# Altium project PCB_WSD.PrjPCB
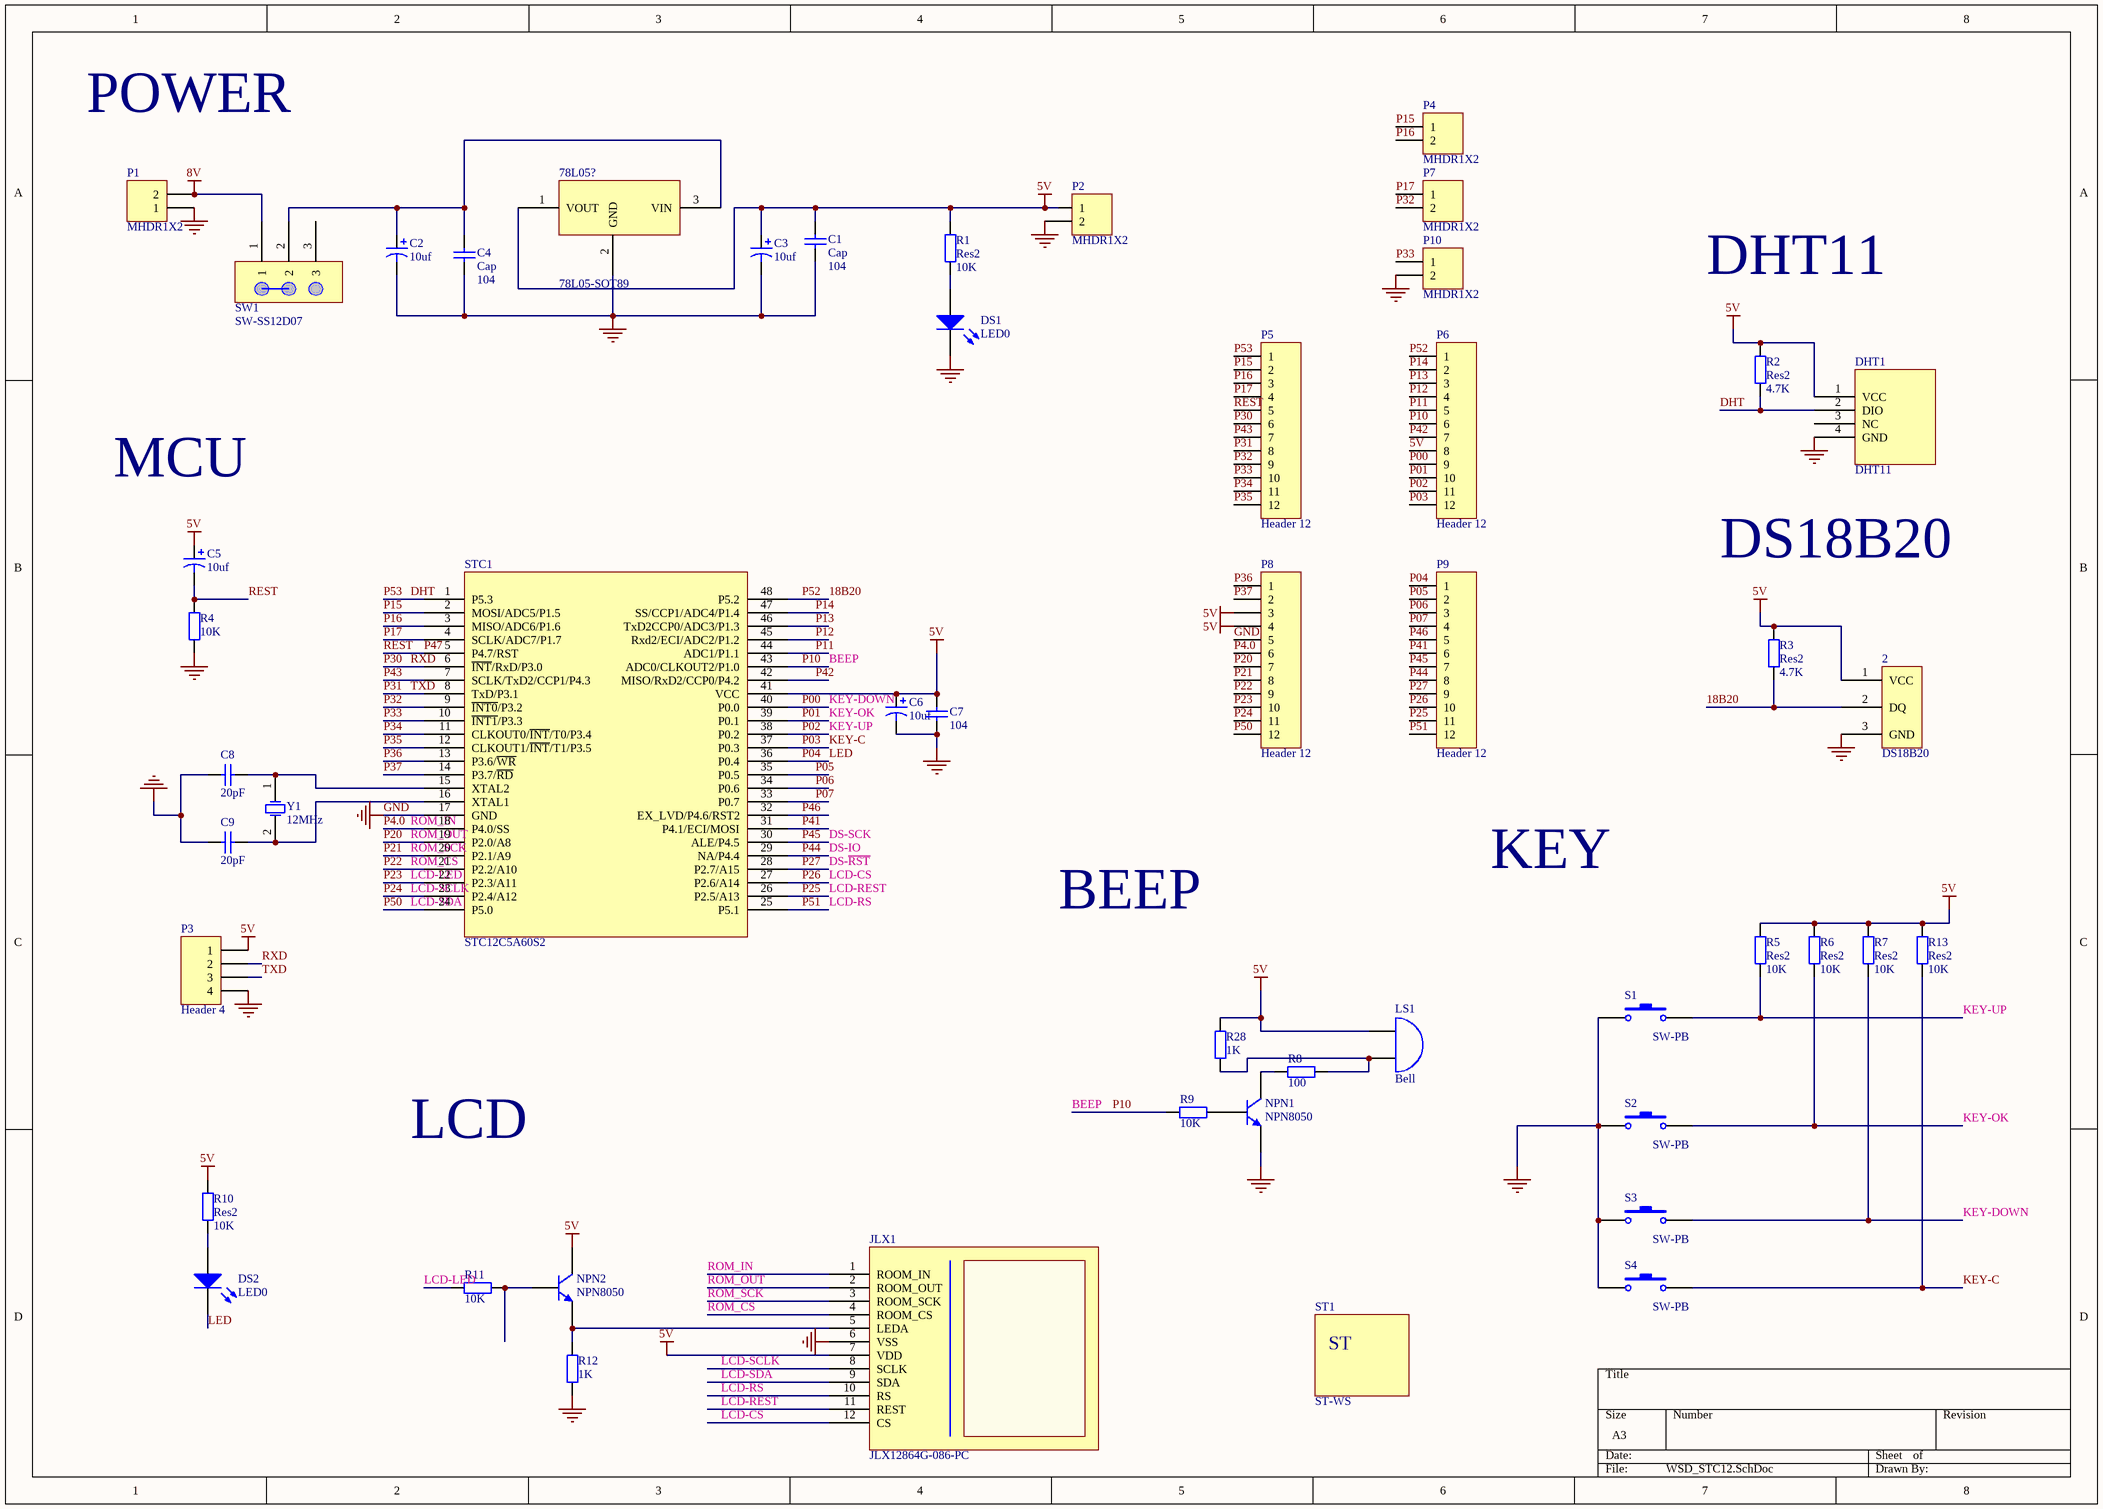
[diagram p0: WSD_STC12.SchDoc]
1 sheet, 50 parts. Net scope: global (net labels, ports and power ports of the same name join across sheets).
Board file: PCB_WSD.PcbDoc

## Sheet WSD_STC12.SchDoc
size A3

### Parts
2  DS18B20  [HDR1X3]
78L05?  78L05-SOT89  [SOT89]
C1  Cap  value 104  [0603]
C2  10uf  [C310M]
C3  10uf  [C310M]
C4  Cap  value 104  [0603]
C5  10uf  [C310M]
C6  10uf  [C310M]
C7  104  [0603]
C8  20pF  [P0603]
C9  20pF  [P0603]
DHT1  DHT11  [HDR1X4]
DS1  LED0  [LED2012]
DS2  LED0  [LED2012]
JLX1  JLX12864G-086-PC  [HDR1X12]
LS1  Bell  [BEEP]
NPN1  NPN8050  [SOT23-T]
NPN2  NPN8050  [SOT23-T]
P1  MHDR1X2  [KF301-2P]
P2  MHDR1X2  [KF301-2P]
P3  Header 4  [HDR1X4]
P4  MHDR1X2  [KF301-2P]
P5  Header 12  [HDR1X12]
P6  Header 12  [HDR1X12]
P7  MHDR1X2  [KF301-2P]
P8  Header 12  [HDR1X12]
P9  Header 12  [HDR1X12]
P10  MHDR1X2  [KF301-2P]
R1  Res2  value 10K  [0603]
R2  Res2  value 4.7K  [0603]
R3  Res2  value 4.7K  [0603]
R4  10K  [0603]
R5  Res2  value 10K  [P0603]
R6  Res2  value 10K  [P0603]
R7  Res2  value 10K  [P0603]
R8  100  [P0603]
R9  10K  [P0603]
R10  Res2  value 10K  [0603]
R11  10K  [P0603]
R12  1K  [P0603]
R13  Res2  value 10K  [P0603]
R28  1K  [P0603]
S1  SW-PB  [KEY-SMD]
S2  SW-PB  [KEY-SMD]
S3  SW-PB  [KEY-SMD]
S4  SW-PB  [KEY-SMD]
ST1  ST-WS  [ST2]
STC1  STC12C5A60S2  [LQFP48_M]
SW1  SW-SS12D07  [SS-12F44]
Y1  12MHz  [XTA]

### Nets
5V: 2.1(VCC) 78L05?.1(VOUT) C1.2 C3.1 C5.1 C6.1 C7.2 DHT1.1(VCC) JLX1.7(VDD) LS1.1(A) NPN2.3(C) P2.1 P3.1 P6.8 P8.3 P8.4 R1.2 R2.2 R3.2 R5.2 R6.1 R7.1 R10.2 R13.1 R28.1 STC1.41(VCC)
8V: P1.2 SW1.1
GND: 2.3(GND) 78L05?.2(GND) C1.1 C2.2 C3.2 C4.1 C6.2 C7.1 C8.2 C9.2 DHT1.4(GND) DS1.2(K) JLX1.6(VSS) NPN1.2(E) P1.1 P2.2 P3.4 P8.5 P10.2 R4.1 R12.1 S1.1 S2.1 S3.1 S4.1 STC1.17(GND)
18B20: 2.2(DQ) P6.1 R3.1 STC1.48(P5.2)  [also labelled P52]
BEEP: P6.6 R9.2 STC1.43(ADC0/CLKOUT2/P1.0)  [also labelled P10]
DHT: DHT1.2(DIO) P5.1 R2.1 STC1.1(P5.3)  [also labelled P53]
DS-IO: P9.8 STC1.29(NA/P4.4)  [also labelled P44]
DS-~{RST}: P9.9 STC1.28(P2.7/A15)  [also labelled P27]
DS-SCK: P9.7 STC1.30(ALE/P4.5)  [also labelled P45]
KEY-C: P6.12 R13.2 S4.2 STC1.37(P0.3)  [also labelled P03]
KEY-DOWN: P6.9 R7.2 S3.2 STC1.40(P0.0)  [also labelled P00]
KEY-OK: P6.10 R6.2 S2.2 STC1.39(P0.1)  [also labelled P01]
KEY-UP: P6.11 R5.1 S1.2 STC1.38(P0.2)  [also labelled P02]
LCD-CS: JLX1.12(CS) P9.10 STC1.27(P2.6/A14)  [also labelled P26]
LCD-LED: P8.10 R11.1 STC1.22(P2.3/A11)  [also labelled P23]
LCD-REST: JLX1.11(REST) P9.11 STC1.26(P2.5/A13)  [also labelled P25]
LCD-RS: JLX1.10(RS) P9.12 STC1.25(P5.1)  [also labelled P51]
LCD-SCLK: JLX1.8(SCLK) P8.11 STC1.23(P2.4/A12)  [also labelled P24]
LCD-SDA: JLX1.9(SDA) P8.12 STC1.24(P5.0)  [also labelled P50]
LED: DS2.2(K) P9.1 STC1.36(P0.4)  [also labelled P04]
P4.0: JLX1.1(ROOM_IN) P8.6 STC1.18(P4.0/SS)  [also labelled ROM_IN]
P05: P9.2 STC1.35(P0.5)
P06: P9.3 STC1.34(P0.6)
P07: P9.4 STC1.33(P0.7)
P11: P6.5 STC1.44(ADC1/P1.1)
P12: P6.4 STC1.45(Rxd2/ECI/ADC2/P1.2)
P13: P6.3 STC1.46(TxD2CCP0/ADC3/P1.3)
P14: P6.2 STC1.47(SS/CCP1/ADC4/P1.4)
P15: P4.1 P5.2 STC1.2(MOSI/ADC5/P1.5)
P16: P4.2 P5.3 STC1.3(MISO/ADC6/P1.6)
P17: P5.4 P7.1 STC1.4(SCLK/ADC7/P1.7)
P20: JLX1.2(ROOM_OUT) P8.7 STC1.19(P2.0/A8)  [also labelled ROM_OUT]
P21: JLX1.3(ROOM_SCK) P8.8 STC1.20(P2.1/A9)  [also labelled ROM_SCK]
P22: JLX1.4(ROOM_CS) P8.9 STC1.21(P2.2/A10)  [also labelled ROM_CS]
P30: P3.2 P5.6 STC1.6(~{INT}/RxD/P3.0)  [also labelled RXD]
P31: P3.3 P5.8 STC1.8(TxD/P3.1)  [also labelled TXD]
P32: P5.9 P7.2 STC1.9(~{INT0}/P3.2)
P33: P5.10 P10.1 STC1.10(~{INT1}/P3.3)
P34: P5.11 STC1.11(CLKOUT0/~{INT}/T0/P3.4)
P35: P5.12 STC1.12(CLKOUT1/~{INT}/T1/P3.5)
P36: P8.1 STC1.13(P3.6/~{WR})
P37: P8.2 STC1.14(P3.7/~{RD})
P41: P9.6 STC1.31(P4.1/ECI/MOSI)
P42: P6.7 STC1.42(MISO/RxD2/CCP0/P4.2)
P43: P5.7 STC1.7(SCLK/TxD2/CCP1/P4.3)
P46: P9.5 STC1.32(EX_LVD/P4.6/RST2)
P47: C5.2 P5.5 R4.2 STC1.5(P4.7/RST)  [also labelled REST]
Net78L05?_3: 78L05?.3(VIN) C2.1 C4.2 SW1.2
NetC8_1: C8.1 STC1.15(XTAL2) Y1.1(OSC1)
NetC9_1: C9.1 STC1.16(XTAL1) Y1.2(OSC2)
NetDS1_1: DS1.1(A) R1.1
NetDS2_1: DS2.1(A) R10.1
NetJLX1_5: JLX1.5(LEDA) NPN2.2(E) R12.2
NetLS1_2: LS1.2(B) R8.1 R28.2
NetNPN1_1: NPN1.1(B) R9.1
NetNPN1_3: NPN1.3(C) R8.2
NetNPN2_1: NPN2.1(B) R11.2

Not connected (* = marked no-connect by the designer): DHT1 3(NC); SW1 3

### Notes on the sheet
- POWER
- DHT11
- MCU
- DS18B20
- BEEP
- KEY
- LCD
- (in symbol ST-WS) ST

### Library data of the parts
C1 C4 C7-C9 = Cap: Capacitor; Published: 8-Jun-2000; LatestRevisionDate: 17-Jul-2002; LatestRevisionNote: Re-released for DXP Platform.; Publisher: Altium Limited
  C7: Value: 104
  C8 C9: Value: 20pF
C2 C3 C5 C6 = Cap Pol3: Polarized Capacitor (Surface Mount); Published: 8-Jun-2000; LatestRevisionDate: 17-Jul-2002; LatestRevisionNote: Re-released for DXP Platform.; PackageReference: C0805; Publisher: Altium Limited; Value: 10uf
DS1 DS2 = LED0: Typical INFRARED GaAs LED; Published: 8-Jun-2000; LatestRevisionDate: 17-Jul-2002; LatestRevisionNote: Re-released for DXP Platform.; Publisher: Altium Limited
LS1 = Bell: Electrical Bell; Published: 24-Mar-1999; LatestRevisionDate: 17-Jul-2002; LatestRevisionNote: Re-released for DXP Platform.; Publisher: Altium Limited
P1 P2 P4 P7 P10 = MHDR1X2: Header, 2-Pin; LatestRevisionDate: 17-Jul-2002; LatestRevisionNote: Re-released for DXP Platform.; Publisher: Altium Limited
P3 = Header 4: Header, 4-Pin; LatestRevisionDate: 17-Jul-2002; LatestRevisionNote: Re-released for DXP Platform.; Publisher: Altium Limited
P5 P6 P8 P9 = Header 12: Header, 12-Pin; LatestRevisionDate: 17-Jul-2002; LatestRevisionNote: Re-released for DXP Platform.; Publisher: Altium Limited
R1-R7 R9-R13 R28 = Res2: Resistor; Published: 8-Jun-2000; LatestRevisionDate: 17-Jul-2002; LatestRevisionNote: Re-released for DXP Platform.; Publisher: Altium Limited
  R4 R9 R11: Value: 10K
  R12 R28: Value: 1K
R8 = Res2: Resistor; Value: 1K; Published: 8-Jun-2000; LatestRevisionDate: 17-Jul-2002; LatestRevisionNote: Re-released for DXP Platform.; Publisher: Altium Limited
S1-S4 = SW-PB: Switch; Published: 24-Mar-1999; LatestRevisionDate: 17-Jul-2002; LatestRevisionNote: Re-released for DXP Platform.; Publisher: Altium Limited
Y1 = XTAL: Crystal Oscillator; Published: 8-Jun-2000; LatestRevisionDate: 17-Jul-2002; LatestRevisionNote: Re-released for DXP Platform.; Publisher: Altium Limited